# EAGLE design schematic_master (EAGLE 9.6.2)
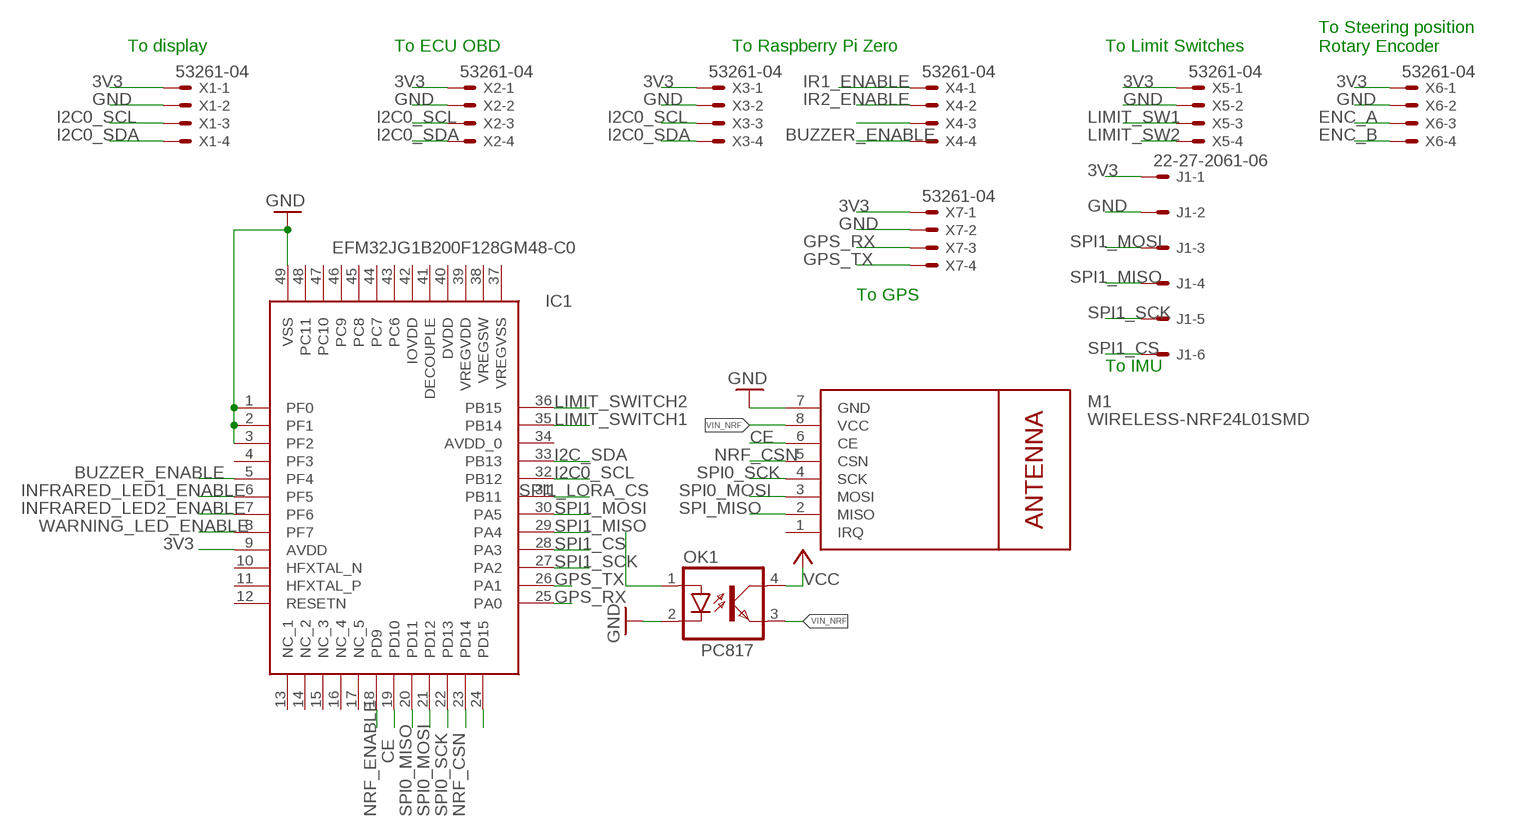
[diagram p0: schematic, sheet 1]

## Parts
IC1  EFM32JG1B200F128GM48-C0  [QFN50P700X700X90-49N]
J1  22-27-2061-06  [6410-06]
M1  WIRELESS-NRF24L01SMD  [WIRELESS-NRF24L01-SMD]
OK1  PC817  [DIL04]
X1  53261-04  [53261-04]
X2  53261-04  [53261-04]
X3  53261-04  [53261-04]
X4  53261-04  [53261-04]
X5  53261-04  [53261-04]
X6  53261-04  [53261-04]
X7  53261-04  [53261-04]

## Nets
3V3: IC1.9(AVDD) J1.1 X1.1 X2.1 X3.1 X5.1 X6.1 X7.1
BUZZER_ENABLE: IC1.5(PF4) X4.3
CE: IC1.19(PD10) M1.6(CE)
ENC_A: X6.3
ENC_B: X6.4
GND: IC1.1(PF0) IC1.2(PF1) IC1.3(PF2) IC1.49(VSS) J1.2 M1.7(GND) OK1.2(C) X1.2 X2.2 X3.2 X5.2 X6.2 X7.2
GPS_RX: IC1.25(PA0) X7.3
GPS_TX: IC1.26(PA1) X7.4
I2C0_SCL: IC1.32(PB12) X1.3 X2.3 X3.3
I2C0_SDA: X1.4 X2.4 X3.4
I2C_SDA: IC1.33(PB13)
INFRARED_LED1_ENABLE: IC1.6(PF5)
INFRARED_LED2_ENABLE: IC1.7(PF6)
IR1_ENABLE: X4.1
IR2_ENABLE: X4.2
LIMIT_SW1: X5.3
LIMIT_SW2: X5.4
LIMIT_SWITCH1: IC1.35(PB14)
LIMIT_SWITCH2: IC1.36(PB15)
N$7: IC1.24(PD15)
N$8: OK1.1(A)
N$11: X4.4
NRF_CSN: IC1.23(PD14) M1.5(CSN)
NRF_ENABLE: IC1.18(PD9)
SPI0_MISO: IC1.20(PD11)
SPI0_MOSI: IC1.21(PD12) M1.3(MOSI)
SPI0_SCK: IC1.22(PD13) M1.4(SCK)
SPI1_CS: IC1.28(PA3) J1.6
SPI1_LORA_CS: IC1.31(PB11)
SPI1_MISO: IC1.29(PA4) J1.4
SPI1_MOSI: IC1.30(PA5) J1.3
SPI1_SCK: IC1.27(PA2) J1.5
SPI_MISO: M1.2(MISO)
VCC: OK1.4(COL)
VIN_NRF: M1.8(VCC) OK1.3(EMIT)
WARNING_LED_ENABLE: IC1.8(PF7)
Unconnected: IC1.4(PF3) IC1.10(HFXTAL_N) IC1.11(HFXTAL_P) IC1.12(RESETN) IC1.13(NC_1) IC1.14(NC_2) IC1.15(NC_3) IC1.16(NC_4) IC1.17(NC_5) IC1.34(AVDD_0) IC1.37(VREGVSS) IC1.38(VREGSW) IC1.39(VREGVDD) IC1.40(DVDD) IC1.41(DECOUPLE) IC1.42(IOVDD) IC1.43(PC6) IC1.44(PC7) IC1.45(PC8) IC1.46(PC9) IC1.47(PC10) IC1.48(PC11) M1.1(IRQ)

## Notes on the sheet
- To display | To ECU OBD | To Raspberry Pi Zero | To Limit Switches
- To Steering position
  Rotary Encoder
- To GPS
- To IMU

## Library data of the parts
IC1 = EFM32JG1B200F128GM48-C0:EFM32JG1B200F128GM48-C0: SILICON LABS - EFM32JG1B200F128GM48-C0 - MCU, 32BIT, 40MHZ, QFN-48 Source: Datasheet <https://www.silabs.com/documents/public/data-sheets/efm32jg1-datasheet.pdf>; ARROW_PART_NUMBER: EFM32JG1B200F128GM48-C0; ARROW_PRICE-STOCK: https://www.arrow.com/en/products/efm32jg1b200f128gm48-c0/silicon-labs?region=nac; DESCRIPTION: SILICON LABS - EFM32JG1B200F128GM48-C0 - MCU, 32BIT, 40MHZ, QFN-48; HEIGHT: 0.9mm; MANUFACTURER_NAME: Silicon Labs; MANUFACTURER_PART_NUMBER: EFM32JG1B200F128GM48-C0; MOUSER_PART_NUMBER: 634-JG1B200F128GM48C; MOUSER_PRICE-STOCK: https://www.mouser.co.uk/ProductDetail/Silicon-Labs/EFM32JG1B200F128GM48-C0?qs=9HM%2FdYkAMWzuxWeD8RFlTw%3D%3D
J1 = con-molex:22-?-06: CONNECTOR wire to board 2.54 mm (.1 inch) pitch header; MF: MOLEX; OC_FARNELL: unknown; OC_NEWARK: unknown
M1 = nrf24l01plus:WIRELESS-NRF24L01: 2.4 GHz Wireless Module based on NRF24L01 chip
OK1 = optocoupler:PC817: SHARP OPTO COUPLER; MPN: PC817X4J000F; OC_FARNELL: 9707727; OC_NEWARK: 97K7059
X1-X7 = con-molex:53?-04: CONNECTOR wire to board 1.25 mm (.049 inch) pitch header; MF: MOLEX; OC_FARNELL: 1125374; OC_NEWARK: unknown

## Net classes
0 default: width 0.305 mm

## Board
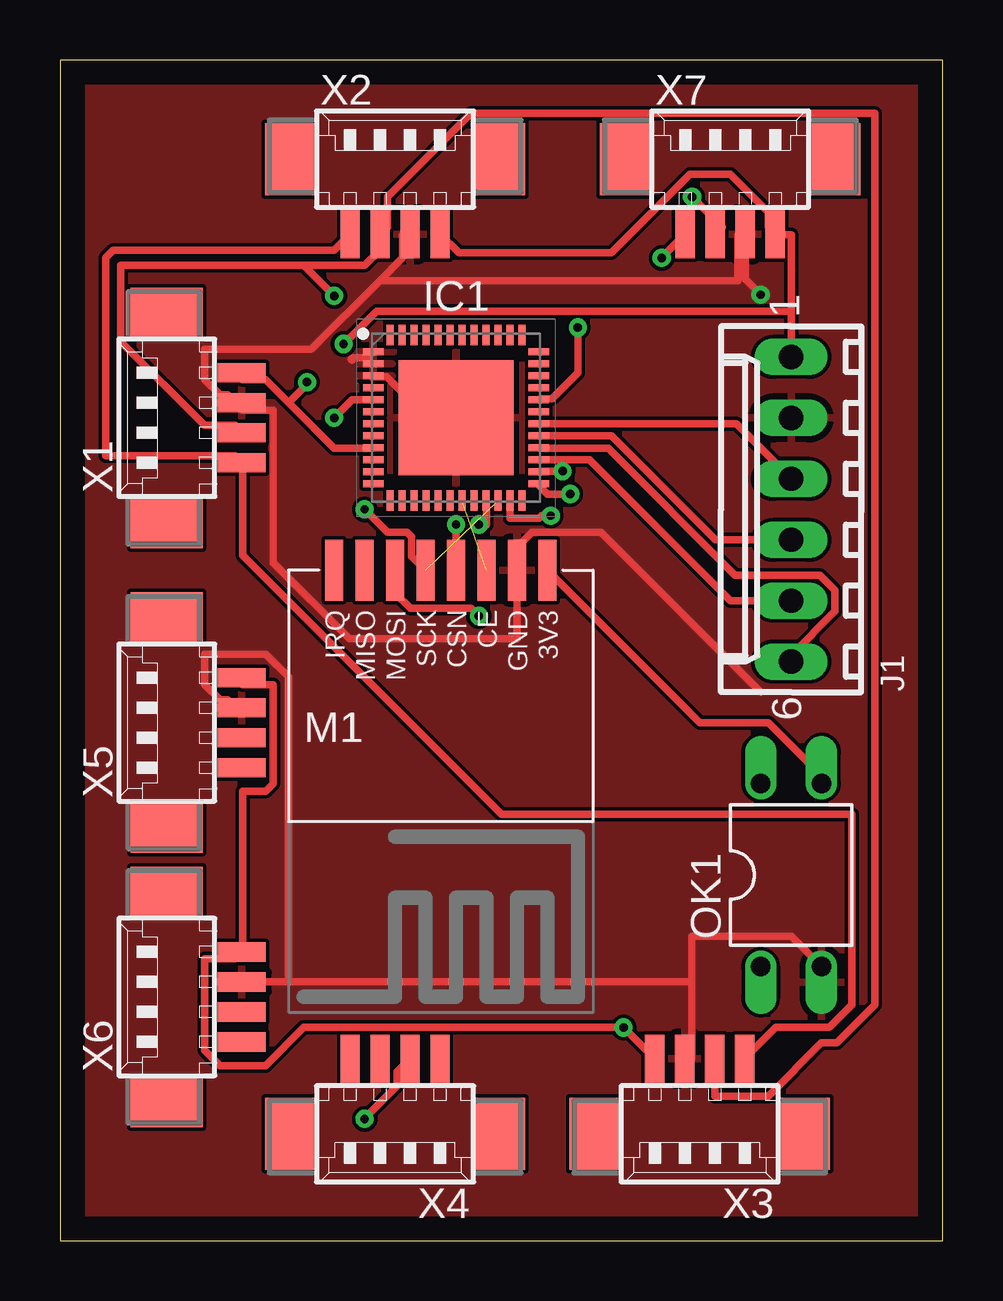
[diagram p1: board, top side]
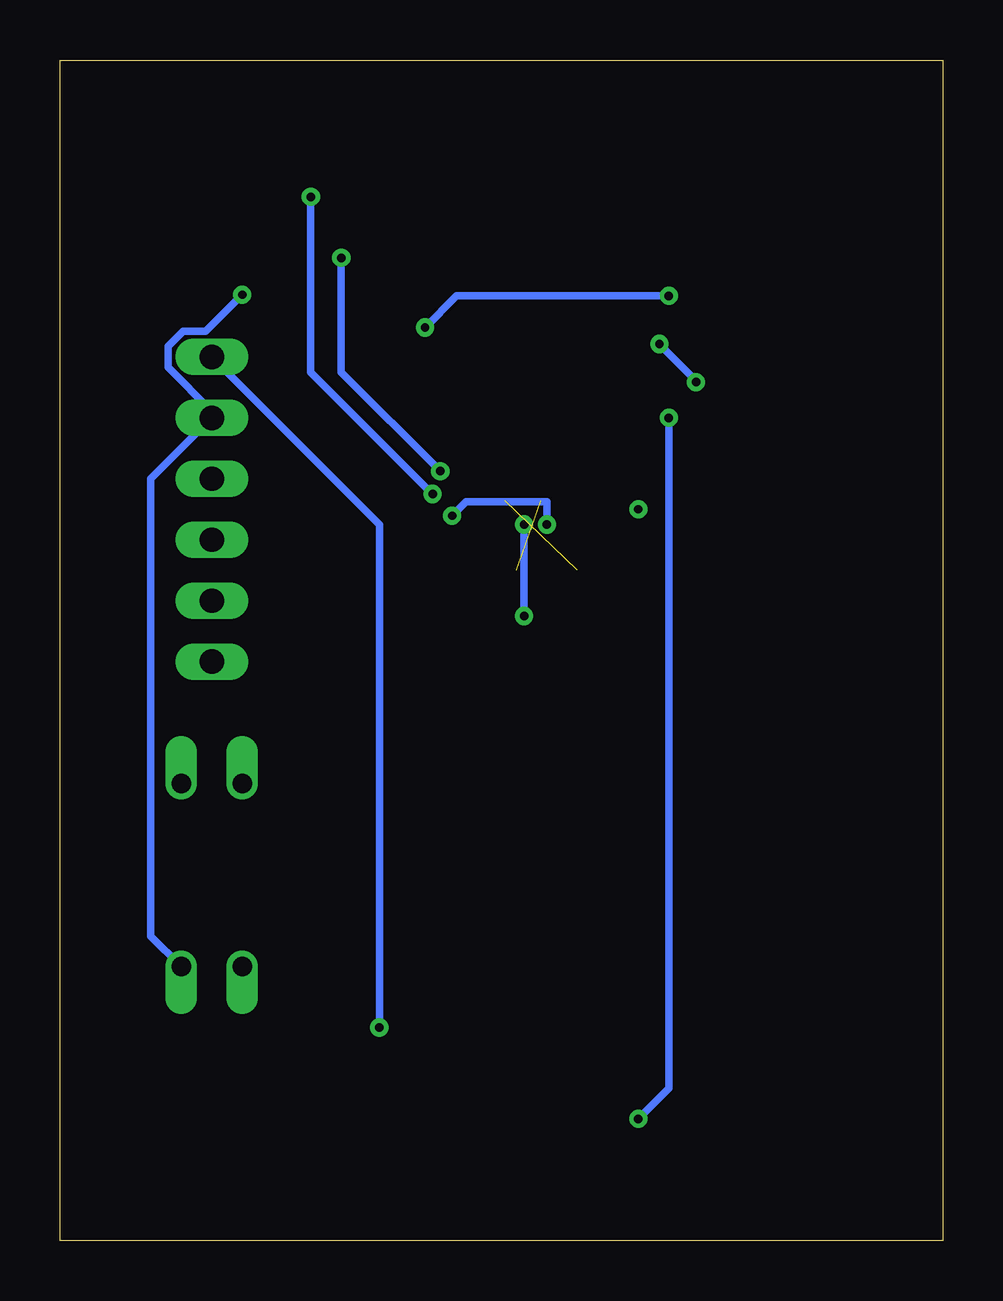
[diagram p2: board, bottom side, seen from below]

Size 36.81 x 49.2 mm. Coordinates in mm from the lower left corner, seen from the top.
Outline: 0,0 36.81,0 36.81,49.2 0,49.2 0,0
Copper layers (1*16): Top 0.035mm / dielectric 1.5mm / Bottom 0.035mm
Design rules "default": minimum track width 6mil, minimum drill 0.35mm, track to track 6mil, track to pad 6mil, pad to pad 6mil, via to via 6mil, smd to smd 6mil, copper to edge 40mil, drill to drill 6mil, minimum pad ring 10mil, minimum via ring 8mil, stop-mask expansion 4mil, vias tented up to drill 0mil, thermal gap 10mil

### Footprints (pad centres in the part's own frame; a part is rotated, then mirrored left to right if it is on the bottom)
QFN50P700X700X90-49N = smd 0.85 x 0.3: 1 -3.45,2.75; 2 -3.45,2.25; 3 -3.45,1.75; 4 -3.45,1.25; 5 -3.45,0.75; 6 -3.45,0.25; 7 -3.45,-0.25; 8 -3.45,-0.75; 9 -3.45,-1.25; 10 -3.45,-1.75; 11 -3.45,-2.25; 12 -3.45,-2.75; 25 3.45,-2.75; 26 3.45,-2.25; 27 3.45,-1.75; 28 3.45,-1.25; 29 3.45,-0.75; 30 3.45,-0.25; 31 3.45,0.25; 32 3.45,0.75; 33 3.45,1.25; 34 3.45,1.75; 35 3.45,2.25; 36 3.45,2.75 | smd 0.3 x 0.85: 13 -2.75,-3.45; 14 -2.25,-3.45; 15 -1.75,-3.45; 16 -1.25,-3.45; 17 -0.75,-3.45; 18 -0.25,-3.45; 19 0.25,-3.45; 20 0.75,-3.45; 21 1.25,-3.45; 22 1.75,-3.45; 23 2.25,-3.45; 24 2.75,-3.45; 37 2.75,3.45; 38 2.25,3.45; 39 1.75,3.45; 40 1.25,3.45; 41 0.75,3.45; 42 0.25,3.45; 43 -0.25,3.45; 44 -0.75,3.45; 45 -1.25,3.45; 46 -1.75,3.45; 47 -2.25,3.45; 48 -2.75,3.45 | smd 4.8 x 4.8: 49 0,0
6410-06 = drill 1.016 long: 1 6.35,0; 2 3.81,0; 3 1.27,0; 4 -1.27,0; 5 -3.81,0; 6 -6.35,0
WIRELESS-NRF24L01-SMD = smd 2.54 x 0.762: 1 1.27,0; 2 1.27,1.27; 3 1.27,2.54; 4 1.27,3.81; 5 1.27,5.08; 6 1.27,6.35; 7 1.27,7.62; 8 1.27,8.89
DIL04 = drill 0.813 offset: 1 -1.27,-3.81; 2 1.27,-3.81; 3 1.27,3.81; 4 -1.27,3.81
53261-04 = smd 0.8 x 2: 1 1.875,-2.5; 2 0.625,-2.5; 3 -0.625,-2.5; 4 -1.875,-2.5 | smd 2.1 x 3: S1 4.375,0.625; S2 -4.375,0.625

### Placement (x,y rotation side)
IC1  16.51,34.29 0 top
J1  30.48,30.48 90 top
M1  11.43,29.21 270 top
OK1  30.48,15.24 0 top
X1  5.08,34.29 90 top
X2  13.97,44.45 0 top
X3  26.67,5.08 180 top
X4  13.97,5.08 180 top
X5  5.08,21.59 90 top
X6  5.08,10.16 90 top
X7  27.94,44.45 0 top

### Tracks (layer width: path | path; a pad name or v marks a point on that pad's centre or on a via)
3V3  (via drill 0.35)
  Top 0.305: 9.52,34.93 8.57,35.88 7.62,35.88 X1.1 | 9.52,34.93 11.43,33.02 13.02,33.02 IC1.9 | X2.1 16.63,41.17 22.98,41.17 26.26,44.45 27.94,44.45 29.53,42.86 29.53,42.23 X7.1 29.84,41.91 30.48,41.91 30.48,38.74 | 30.48,38.74 J1.1 | X5.1 7.62,23.18 8.89,23.18 8.89,19.05 8.57,18.73 7.62,18.73 7.62,12.06 X6.1 7.3,11.75 6.03,11.75 6.03,7.94 6.67,7.3 8.57,7.3 10.16,8.89 v23.49,8.89 24.76,7.62 X3.1 | 9.52,34.93 10.3,35.7 v10.3,35.78 | v11.82,37.37 13.19,38.74 30.48,38.74
  Bottom 0.305: J1.1 23.49,29.84 v23.49,8.89 | v10.3,35.78 10.3,35.84 v11.82,37.37
BUZZER_ENABLE  (via drill 0.35)
  Top 0.305: X4.3 14.05,7.04 14.05,6.45 12.7,5.1 v12.7,5.08 | v11.43,34.29 12.18,35.04 IC1.5
  Bottom 0.305: v12.7,5.08 11.43,6.35 v11.43,34.29
CE  (1 unrouted)
GND  (via drill 0.35)
  Top 0.305: 13.34,40.01 14.29,40.96 14.29,41.91 X2.2 | 13.34,40.01 10.48,37.15 6.03,37.15 6.03,35.88 6.67,35.24 6.98,35.24 7.3,34.93 X1.2 7.62,34.61 8.89,34.61 8.89,28.26 12.06,25.08 19.05,25.08 M1.7 19.05,28.89 19.68,29.53 22.54,29.53 29.21,22.86 | 13.34,40.01 28.26,40.01 28.26,41.91 X7.2 28.56,40.06 v29.21,39.42 | 26.35,10.79 26.35,12.7 30.48,12.7 OK1.2 | 26.35,10.79 26.35,7.62 X3.2 | 26.35,10.79 9.52,10.79 | 9.52,10.79 7.62,10.79 X6.2 | 9.52,10.79 9.52,23.5 8.57,24.45 6.03,24.45 6.03,23.18 6.67,22.54 6.98,22.54 7.3,22.22 X5.2 | IC1.3 13.1,36 13.61,36 15.32,34.29 IC1.49 | IC1.1 12.81,36.79 12.22,36.79 12.14,36.72 12.18,36.69
  Bottom 0.305: OK1.2 33.02,12.7 33.02,31.75 J1.2 30.48,34.56 32.31,36.39 32.31,37.27 31.68,37.9 30.73,37.9 v29.21,39.42
  pour Top: -1.27,50.8 -1.27,0 0,-1.27 36.83,-1.27 39.37,1.27 39.37,48.26 36.83,50.8
GPS_RX  (via drill 0.35)
  Top 0.305: v21.27,31.11 20.32,31.11 20,31.43 IC1.25 | v26.35,43.5 27.62,42.23 X7.3
  Bottom 0.305: v21.27,31.11 26.35,36.2 v26.35,43.5
GPS_TX  (via drill 0.35)
  Top 0.305: v20.95,32.07 20,32.07 IC1.26 | v25.08,40.96 26.04,41.91 X7.4
  Bottom 0.305: v20.95,32.07 25.08,36.2 v25.08,40.96
I2C0_SCL  (via drill 0.35)
  Top 0.305: X3.3 27.3,7.3 27.3,6.03 29.53,6.03 31.75,8.26 32.38,8.26 33.97,9.84 33.97,46.99 17.15,46.99 13.65,43.5 13.65,42.23 X2.3 13.34,41.91 13.34,41.28 12.7,40.64 10.16,40.64 | 10.16,40.64 2.54,40.64 2.54,37.47 6.03,33.97 7.3,33.97 X1.3 | IC1.32 20.01,35.09 20.51,35.09 21.59,36.16 v21.59,38.05 | v11.43,39.37 10.16,40.64
  Bottom 0.305: v21.59,38.05 20.27,39.37 v11.43,39.37
I2C0_SDA
  Top 0.305: X3.4 28.57,7.62 29.84,8.89 32.07,8.89 33.02,9.84 33.02,17.78 18.41,17.78 7.62,28.57 7.62,32.38 X1.4 7.3,32.7 1.9,32.7 1.9,40.96 2.22,41.28 11.43,41.28 12.06,41.91 X2.4
NRF_CSN  (via drill 0.35)
  Top 0.305: v20.46,30.21 20.08,30.21 19.97,30.1 18.76,30.1 18.76,30.11 IC1.23 | M1.5 v16.51,29.84
  Bottom 0.305: v20.46,30.21 19.87,30.8 16.51,30.8 v16.51,29.84
SPI0_MOSI  (via drill 0.35)
  Top 0.305: v17.46,29.84 17.78,29.84 17.78,30.8 IC1.21 | v17.46,26.04 17.15,26.35 14.6,26.35 13.97,26.99 M1.3
  Bottom 0.305: v17.46,26.04 v17.46,29.84
SPI0_SCK  (via drill 0.35)  (1 unrouted)
  Top 0.305: M1.4 14.66,28.52 14.66,29.34 14.48,29.52 13.66,29.52 v12.7,30.48
SPI1_CS
  Top 0.305: IC1.28 20,33.02 22.86,33.02 28.14,27.74 31.68,27.74 32.31,27.11 32.31,26.23 30.48,24.4 J1.6
SPI1_MISO
  Top 0.305: J1.4 27.32,29.21 22.99,33.53 IC1.29
SPI1_MOSI
  Top 0.305: IC1.30 28.19,34.04 J1.3
SPI1_SCK
  Top 0.305: IC1.27 22.07,32.54 27.94,26.67 J1.5
VIN_NRF
  Top 0.305: M1.8 26.67,21.59 29.53,21.59 31.75,19.37 OK1.3